# EAGLE design MainController (EAGLE 7.2.0)
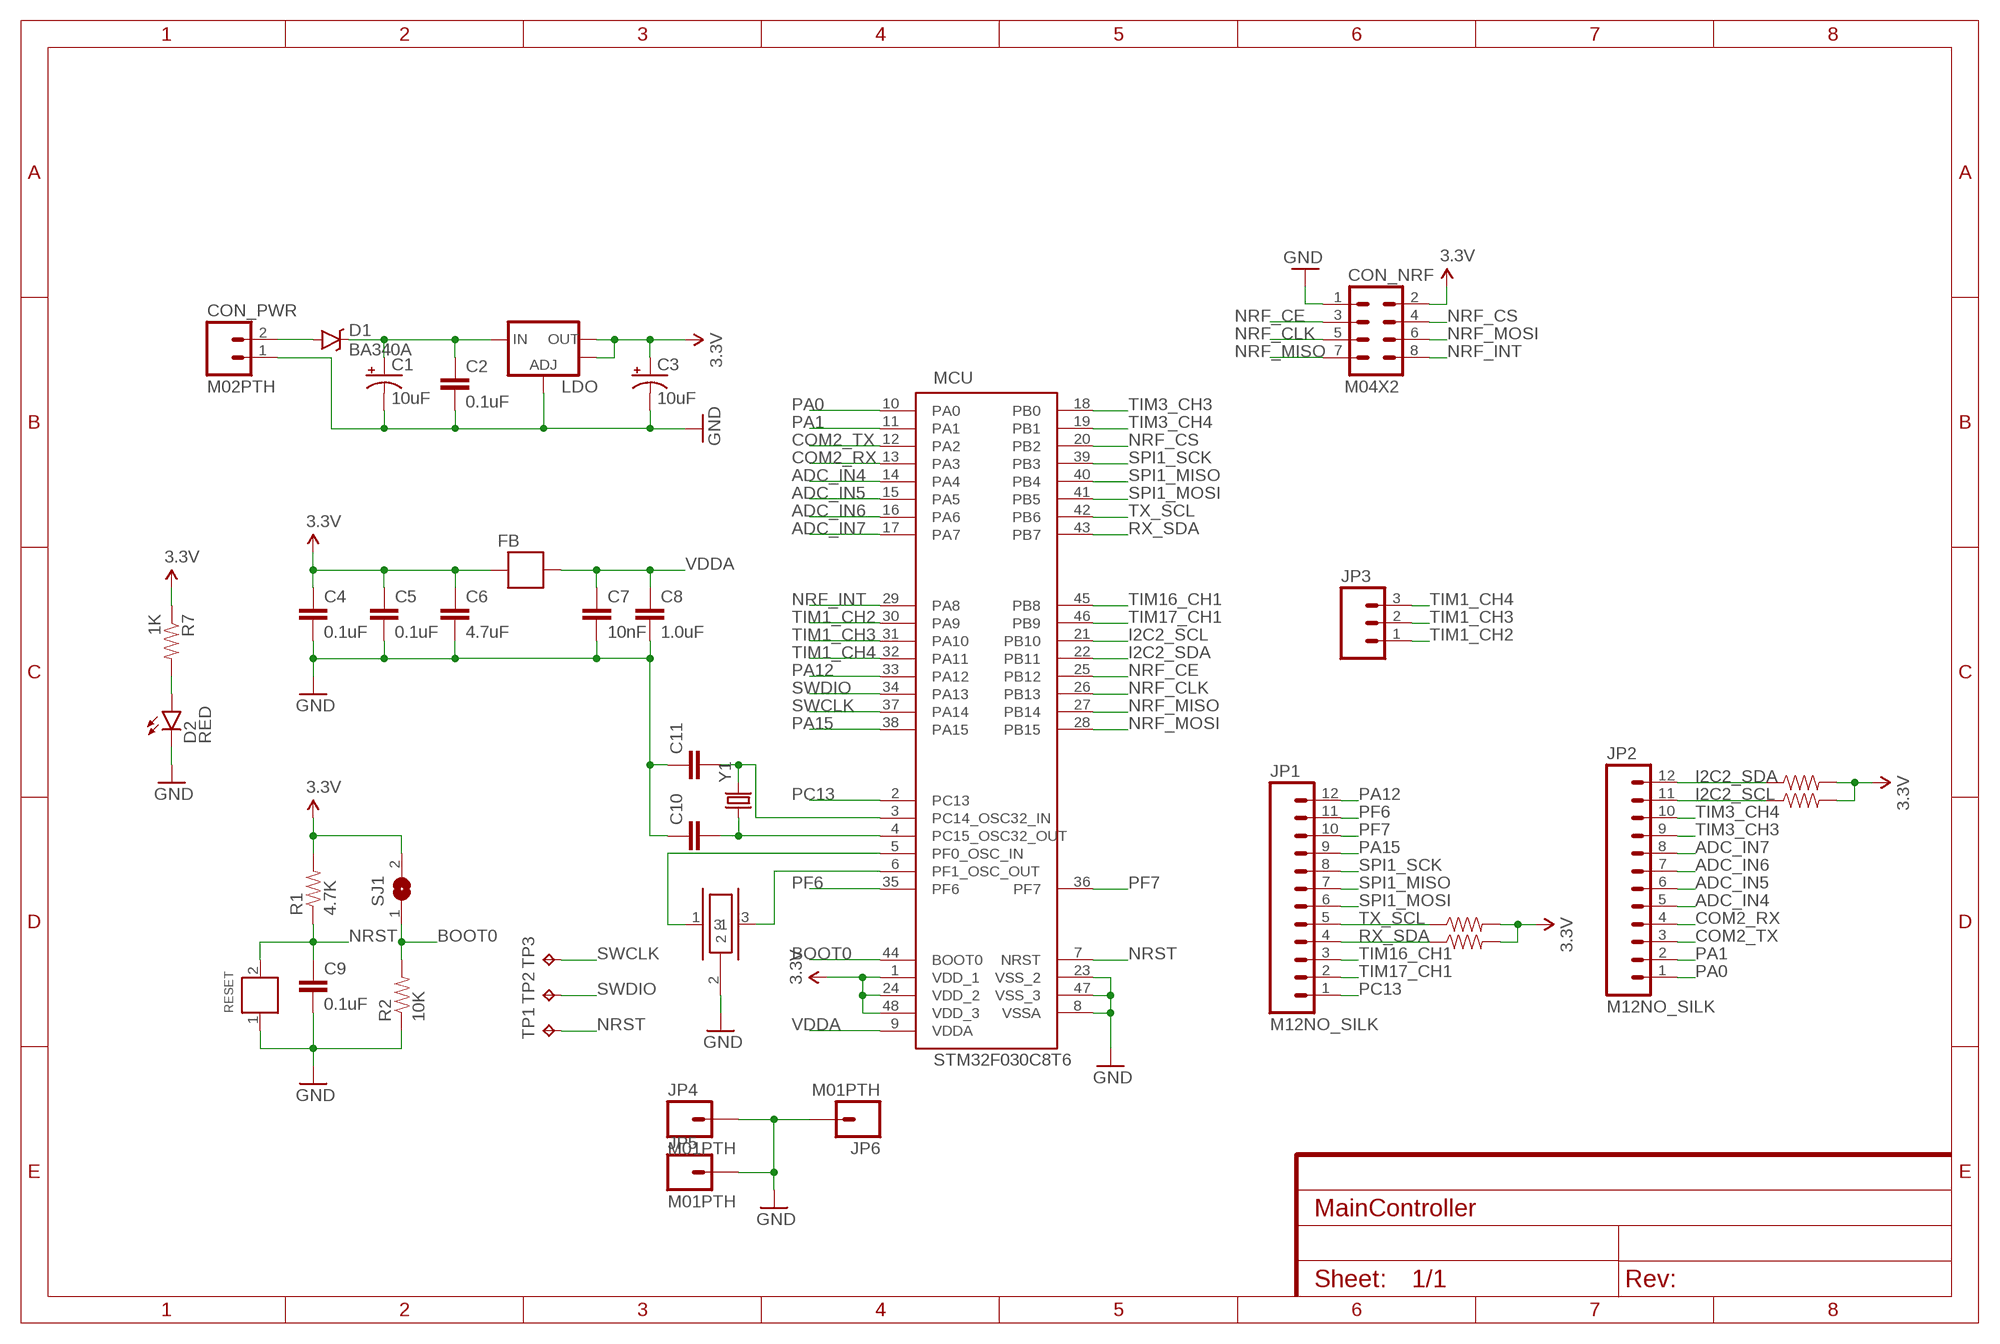
[diagram p0: schematic, sheet 1]

## Parts
C1  10uF  10UF-16V-10%(TANT)  [EIA3216]
C2  0.1uF  0.1UF-25V-5%(0603)  [0603-CAP]
C3  10uF  10UF-16V-10%(TANT)  [EIA3216]
C4  0.1uF  0.1UF-25V-5%(0603)  [0603-CAP]
C5  0.1uF  0.1UF-25V-5%(0603)  [0603-CAP]
C6  4.7uF  4.7UF-6.3V-10%(0603)0603  [0603-CAP]
C7  10nF  10NF/10000PF-50V-10%(0603)  [0603-CAP]
C8  1.0uF  1.0UF-16V-10%(0603)  [0603-CAP]
C9  0.1uF  0.1UF-100V-10%(0603)  [0603-CAP]
C10  CAP0603-CAP  [0603-CAP]
C11  CAP0603-CAP  [0603-CAP]
CON_NRF  M04X2  [2X4]
CON_PWR  M02PTH  [1X02]
D1  BA340A  B340A  [SMA-DIODE]
D2  RED  LED-RED0603  [LED-0603]
FB  FBFB0805  [0805W]
JP1  M12NO_SILK  [1X12_NO_SILK]
JP2  M12NO_SILK  [1X12_NO_SILK]
JP3  M031X03_NO_SILK  [1X03_NO_SILK]
JP4  M01PTH  [1X01]
JP5  M01PTH  [1X01]
JP6  M01PTH  [1X01]
LDO  V_REG_LM1117SOT223  [SOT223]
MCU  STM32F030C8T6  [TQFP48]
OSC  CSTCE8M00G52-R0  [CSTCE_M_G]
R1  4.7K  4.7KOHM-1/10W-1%(0603)  [0603-RES]
R2  10K  10KOHM-1/10W-1%(0603)0603  [0603-RES]
R3  10K  10OHM-1/10W-5%0603SMD  [0603-RES]
R4  10K  10OHM-1/10W-5%0603SMD  [0603-RES]
R5  10K  10OHM-1/10W-5%0603SMD  [0603-RES]
R6  10K  10OHM-1/10W-5%0603SMD  [0603-RES]
R7  1K  1KOHM-1/10W-1%(0603)  [0603-RES]
RESET  SWITCH_SMD  [SWITCH3X6_SMD]
SJ1  SJ  [SJ]
TP1  TPB1,27  [B1,27]
TP2  TPB1,27  [B1,27]
TP3  TPB1,27  [B1,27]
Y1  CRYSTALTC38H  [TC38H]

## Nets
3.3V: C3.A(+) C4.1 C5.1 C6.1 CON_NRF.2 FB.2 LDO.2(OUT) LDO.4(OUT) MCU.1(VDD_1) MCU.24(VDD_2) MCU.48(VDD_3) R1.2 R3.2 R4.2 R5.2 R6.2 R7.1 SJ1.2
ADC_IN4: JP2.5 MCU.14(PA4)
ADC_IN5: JP2.6 MCU.15(PA5)
ADC_IN6: JP2.7 MCU.16(PA6)
ADC_IN7: JP2.8 MCU.17(PA7)
BOOT0: MCU.44(BOOT0) R2.2 SJ1.1
COM2_RX: JP2.4 MCU.13(PA3)
COM2_TX: JP2.3 MCU.12(PA2)
GND: C1.C(-) C2.2 C3.C(-) C4.2 C5.2 C6.2 C7.2 C8.2 C9.2 C10.1 C11.1 CON_NRF.1 CON_PWR.1 D2.C JP4.1 JP5.1 JP6.1 LDO.1(ADJ) MCU.8(VSSA) MCU.23(VSS_2) MCU.47(VSS_3) OSC.2 R2.1 RESET.1
I2C2_SCL: JP2.11 MCU.21(PB10) R5.1
I2C2_SDA: JP2.12 MCU.22(PB11) R6.1
N$1: MCU.5(PF0_OSC_IN) OSC.1
N$2: MCU.6(PF1_OSC_OUT) OSC.3
N$3: C1.A(+) C2.1 D1.C LDO.3(IN)
N$4: C10.2 MCU.4(PC15_OSC32_OUT) Y1.1
N$5: C11.2 MCU.3(PC14_OSC32_IN) Y1.2
N$6: CON_PWR.2 D1.A
N$7: D2.A R7.2
NRF_CE: CON_NRF.3 MCU.25(PB12)
NRF_CLK: CON_NRF.5 MCU.26(PB13)
NRF_CS: CON_NRF.4 MCU.20(PB2)
NRF_INT: CON_NRF.8 MCU.29(PA8)
NRF_MISO: CON_NRF.7 MCU.27(PB14)
NRF_MOSI: CON_NRF.6 MCU.28(PB15)
NRST: C9.1 MCU.7(NRST) R1.1 RESET.2 TP1.TP
PA0: JP2.1 MCU.10(PA0)
PA1: JP2.2 MCU.11(PA1)
PA12: JP1.12 MCU.33(PA12)
PA15: JP1.9 MCU.38(PA15)
PC13: JP1.1 MCU.2(PC13)
PF6: JP1.11 MCU.35(PF6)
PF7: JP1.10 MCU.36(PF7)
RX_SDA: JP1.4 MCU.43(PB7) R4.1
SPI1_MISO: JP1.7 MCU.40(PB4)
SPI1_MOSI: JP1.6 MCU.41(PB5)
SPI1_SCK: JP1.8 MCU.39(PB3)
SWCLK: MCU.37(PA14) TP3.TP
SWDIO: MCU.34(PA13) TP2.TP
TIM1_CH2: JP3.1 MCU.30(PA9)
TIM1_CH3: JP3.2 MCU.31(PA10)
TIM1_CH4: JP3.3 MCU.32(PA11)
TIM3_CH3: JP2.9 MCU.18(PB0)
TIM3_CH4: JP2.10 MCU.19(PB1)
TIM16_CH1: JP1.3 MCU.45(PB8)
TIM17_CH1: JP1.2 MCU.46(PB9)
TX_SCL: JP1.5 MCU.42(PB6) R3.1
VDDA: C7.1 C8.1 FB.1 MCU.9(VDDA)

## Library data of the parts
C1 C3 = SparkFun-Capacitors:10UF-16V-10%(TANT): CAP-00811 1206/EIA-3216 Tantalum capacitor; PROD_ID: CAP-00811
C2 C4 C5 = SparkFun-Capacitors:0.1UF-25V-5%(0603): CAP-08604; PROD_ID: CAP-08604
C6 = SparkFun-Capacitors:4.7UF-6.3V-10%(0603): CAP-08280; PROD_ID: CAP-08280
C7 = SparkFun-Capacitors:10NF/10000PF-50V-10%(0603): CAP-00867; PROD_ID: CAP-00867
C8 = SparkFun-Capacitors:1.0UF-16V-10%(0603): CAP-00868; PROD_ID: CAP-00868
C9 = SparkFun-Capacitors:0.1UF-100V-10%(0603): CAP-08390; PROD_ID: CAP-08390
C10 C11 = SparkFun-Capacitors:CAP: Capacitor Standard 0603 ceramic capacitor, and 0.1" leaded capacitor.
CON_NRF = SparkFun-Connectors:M04X2: .1" header, two rows of four.
CON_PWR = SparkFun-Connectors:M02: Standard 2-pin 0.1" header. Use with - straight break away headers ( PRT-00116) - right angle break away headers (PRT-00553) - swiss pins (PRT-00743) - machine pins (PRT-00117) - female headers (PRT-00115) Molex polarized connector foot print use with: PRT-08233 with associated crimp pins and housings. 2.54_SCREWTERM for use with PRT-10571. 3.5mm Screw Terminal footprints for PRT-08084 5mm Screw Terminal footprints for use with PRT-08432
D1 = SparkFun-DiscreteSemi:B340A: Schottky Diode 3A-40V; PROD_ID: DIO-09886
D2 = SparkFun-LED:LED-RED: Assorted Red LEDs LilyPad 1206- DIO-09912 1206- DIO-00809 0603- DIO-00819; PROD_ID: DIO-00819
FB = SparkFun-Passives:FB
JP1 JP2 = SparkFun-Connectors:M12: Header 12 Standard 12-pin 0.1" header. Use with straight break away headers (SKU : PRT-00116), right angle break away headers (PRT-00553), swiss pins (PRT-00743), machine pins (PRT-00117), and female headers (PRT-00115).
JP3 = SparkFun-Connectors:M03: Header 3 Standard 3-pin 0.1" header. Use with straight break away headers (SKU : PRT-00116), right angle break away headers (PRT-00553), swiss pins (PRT-00743), machine pins (PRT-00117), and female headers (PRT-00115). Molex polarized connector foot print use with SKU : PRT-08232 with associated crimp pins and housings.
JP4-JP6 = SparkFun-Connectors:M01: Header 1 Standard 1-pin 0.1" header. Use with straight break away headers (SKU : PRT-00116), right angle break away headers (PRT-00553), swiss pins (PRT-00743), machine pins (PRT-00117), and female headers (PRT-00115).
LDO = SparkFun-PowerIC:V_REG_LM1117: Voltage Regulator LM1117 Standard adjustable voltage regulator but in SMD form. Spark Fun Electronics SKU : COM-00595; PROD_ID: VREG-08170
MCU = stm32:STM32F030C8T6
OSC = murata:CSTCE8M00G52-R0
R1 = SparkFun-Resistors:4.7KOHM-1/10W-1%(0603): RES-07857; PROD_ID: RES-07857
R2 = SparkFun-Resistors:10KOHM-1/10W-1%(0603): RES-00824; PROD_ID: RES-00824
R3-R6 = SparkFun-Resistors:10OHM-1/10W-5%0603: RES-09834; PROD_ID: RES-09834; VALUE: 10
R7 = SparkFun-Resistors:1KOHM-1/10W-1%(0603): RES-07856; PROD_ID: RES-07856
RESET = szjlc:SWITCH_SMD
SJ1 = jumper:SJ: SMD solder JUMPER
TP1-TP3 = testpad:TP: Test pad
Y1 = SparkFun-FreqCtrl:CRYSTAL: Various standard crystals. Proven footprints.

## Board
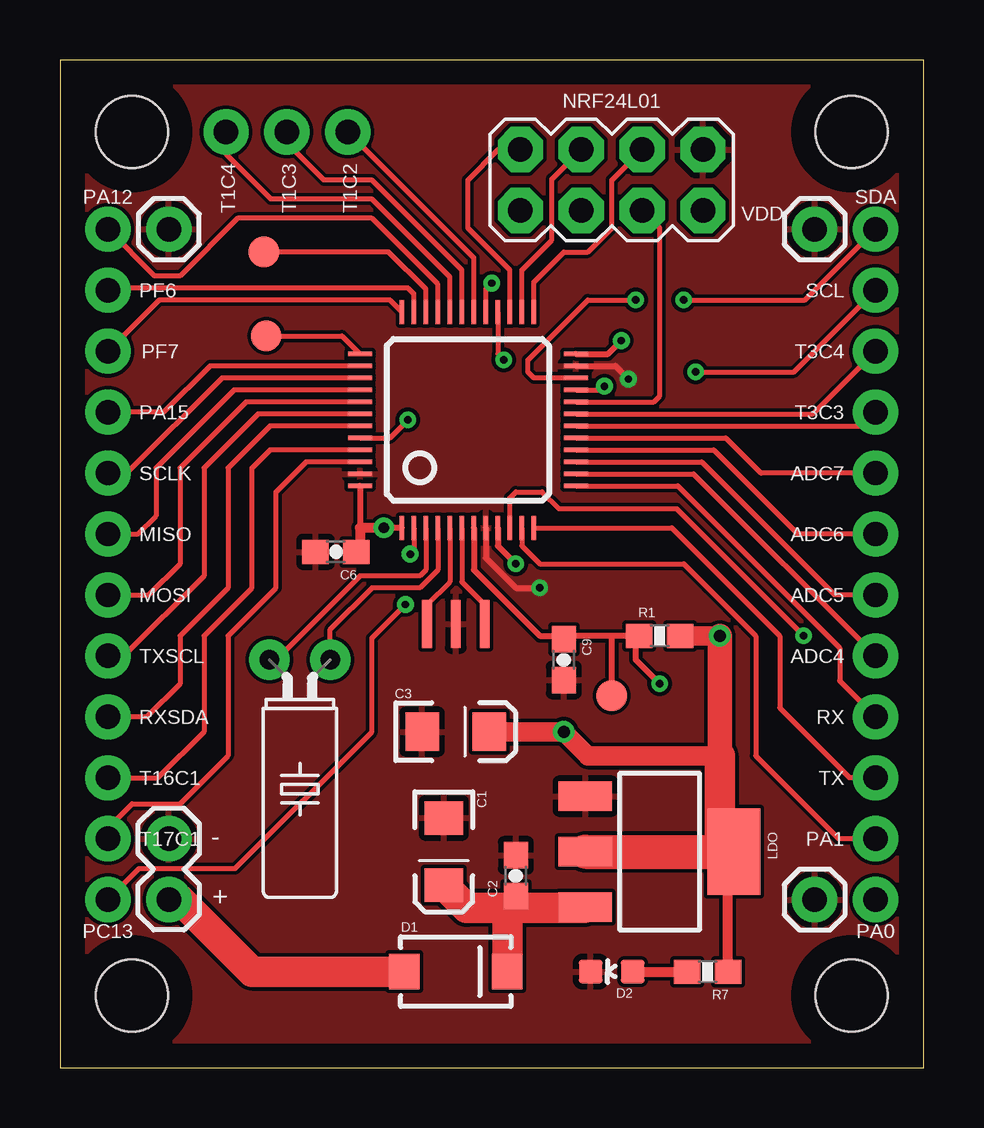
[diagram p1: board, top side]
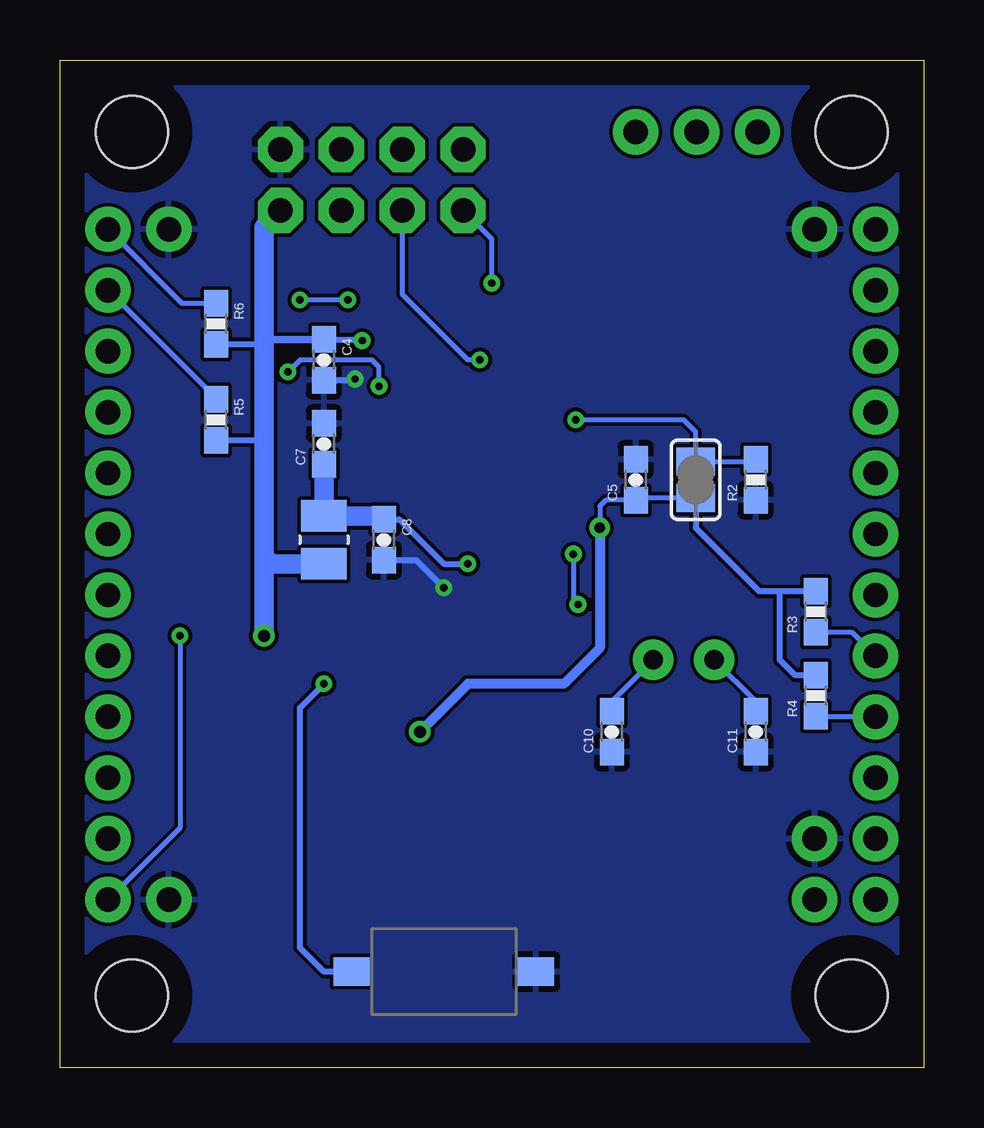
[diagram p2: board, bottom side, seen from below]

Size 36 x 42 mm. Coordinates in mm from the lower left corner, seen from the top.
Outline: 0,0 36,0 36,42 0,42 0,0
Copper layers (1*16): Top 0.035mm / dielectric 1.5mm / Bottom 0.035mm
Design rules "default *": minimum track width 6mil, minimum drill 0.3mm, track to track 6mil, track to pad 6mil, pad to pad 6mil, via to via 6mil, smd to smd 6mil, copper to edge 40mil, drill to drill 8mil, minimum pad ring 10mil, minimum via ring 8mil, stop-mask expansion 4mil, vias tented up to drill 0.5mm, thermal gap 10mil
Holes 3 mm at 3,3 33,3 33,39 3,39

### Footprints (pad centres in the part's own frame; a part is rotated, then mirrored left to right if it is on the bottom)
EIA3216 = smd 1.4 x 1.6: A 1.4,0; C -1.4,0
0603-CAP = smd 1.1 x 1: 1 -0.85,0; 2 0.85,0
2X4 = drill 1.016 pad 1.88 octagon: 1 -3.81,-1.27; 2 -3.81,1.27; 3 -1.27,-1.27; 4 -1.27,1.27; 5 1.27,-1.27; 6 1.27,1.27; 7 3.81,-1.27; 8 3.81,1.27
1X02 = drill 1.016 pad 1.88: 1 0,0; 2 2.54,0
SMA-DIODE = smd 1.27 x 1.47: A -2.15,0; C 2.15,0
LED-0603 = smd 1 x 1: A 0,-0.877; C 0,0.877
0805W = smd 1.3 x 1.9: 1 -1,0; 2 1,0
1X12_NO_SILK = drill 1.016 pad 1.88: 1 0,0; 2 2.54,0; 3 5.08,0; 4 7.62,0; 5 10.16,0; 6 12.7,0; 7 15.24,0; 8 17.78,0; 9 20.32,0; 10 22.86,0; 11 25.4,0; 12 27.94,0
1X03_NO_SILK = drill 1.016 pad 1.88: 1 0,0; 2 2.54,0; 3 5.08,0
1X01 = drill 1.016 pad 1.88: 1 0,0
SOT223 = smd 1.219 x 2.235: 1 -2.311,-3.099; 2 0,-3.099; 3 2.311,-3.099 | smd 3.6 x 2.2: 4 0,3.099
TQFP48 = smd 0.2 x 1: 1 -2.75,-4.5; 2 -2.25,-4.5; 3 -1.75,-4.5; 4 -1.25,-4.5; 5 -0.75,-4.5; 6 -0.25,-4.5; 7 0.25,-4.5; 8 0.75,-4.5; 9 1.25,-4.5; 10 1.75,-4.5; 11 2.25,-4.5; 12 2.75,-4.5; 25 2.75,4.5; 26 2.25,4.5; 27 1.75,4.5; 28 1.25,4.5; 29 0.75,4.5; 30 0.25,4.5; 31 -0.25,4.5; 32 -0.75,4.5; 33 -1.25,4.5; 34 -1.75,4.5; 35 -2.25,4.5; 36 -2.75,4.5 | smd 1 x 0.2: 13 4.5,-2.75; 14 4.5,-2.25; 15 4.5,-1.75; 16 4.5,-1.25; 17 4.5,-0.75; 18 4.5,-0.25; 19 4.5,0.25; 20 4.5,0.75; 21 4.5,1.25; 22 4.5,1.75; 23 4.5,2.25; 24 4.5,2.75; 37 -4.5,2.75; 38 -4.5,2.25; 39 -4.5,1.75; 40 -4.5,1.25; 41 -4.5,0.75; 42 -4.5,0.25; 43 -4.5,-0.25; 44 -4.5,-0.75; 45 -4.5,-1.25; 46 -4.5,-1.75; 47 -4.5,-2.25; 48 -4.5,-2.75
CSTCE_M_G = smd 0.4 x 2: 1 -1.2,0; 2 0,0; 3 1.2,0
0603-RES = smd 1.1 x 1: 1 -0.85,0; 2 0.85,0
SWITCH3X6_SMD = smd 1.5 x 1.2: 1 -3.85,0; 2 3.85,0
SJ = smd 1.168 x 1.6: 1 -0.762,0; 2 0.762,0
B1,27 = smd 1.27 x 1.27: TP 0,0
TC38H = drill 0.813 pad 1.676: 1 -1.27,0; 2 1.27,0

### Placement (x,y rotation side)
C1  16,9 270 top
C2  19,8 90 top
C3  16.5,14 0 top
C4  25,29.5 270 bottom
C5  12,24.5 90 bottom
C6  11.5,21.5 180 top
C7  25,26 90 bottom
C8  22.5,22 270 bottom
C9  21,17 270 top
C10  13,14 90 bottom
C11  7,14 90 bottom
CON_NRF  23,37 180 top
CON_PWR  4.54,9.54 270 top
D1  16.5,4 0 top
D2  23,4 90 top
FB  25,22 270 bottom
JP1  2,7 90 top
JP2  34,7 90 top
JP3  12,39 180 top
JP4  4.54,34.94 0 top
JP5  31.46,34.94 0 top
JP6  31.46,7 0 top
LDO  25,9 270 top
MCU  17,27 0 top
OSC  16.5,18.5 0 top
R1  25,18 0 top
R2  7,24.5 90 bottom
R3  4.5,19 90 bottom
R4  4.5,15.5 90 bottom
R5  29.5,27 270 bottom
R6  29.5,31 270 bottom
R7  27,4 180 top
RESET  20,4 180 bottom
SJ1  9.5,24.5 270 bottom
TP1  23,15.5 0 top
TP2  8.5,34 0 top
TP3  8.6,30.5 0 top
Y1  10,17 180 top

### Tracks (layer width: path | path; a pad name or v marks a point on that pad's centre or on a via)
3.3V  (via drill 0.3, 0.45, 0.5)
  Top 0.254: MCU.24 22.85,29.75 v23.4,30.3 | MCU.48 12.5,22.5 | MCU.1 v13.5,22.5
  Top 0.406: v13.5,22.5 12.5,22.5 12.5,21.65 C6.1 | 28,8.9 LDO.4 27.85,8.75 R7.1
  Top 0.813: R1.2 v27.5,18 | C3.A v21,14 22,13 27.5,13
  Top 1.016: 28.4,9.3 LDO.4 27.5,9.6 | v27.5,18 27.5,13
  Top 1.27: 27.5,13 27.5,9.6
  Top 1.422: LDO.2 LDO.4
  Bottom 0.2: SJ1.2 11.91,23.74 C5.1 13.25,23.65 13.5,23.4 v13.5,22.5
  Bottom 0.254: C4.1 23.45,30.35 v23.4,30.3 | R6.2 27.65,30.15 | R5.2 27.65,26.15 | R3.2 6,19.85 | 6,19.85 6.85,19.85 9.5,22.5 SJ1.2 | R4.2 5.35,16.35 6,17 6,19.85
  Bottom 0.305: C4.1 27.15,30.35 27.5,30
  Bottom 0.406: v13.5,22.5 13.5,17.5 15,16 19,16 v21,14 | 27.65,30.15 27.5,30 | 27.65,26.15 27.5,26
  Bottom 0.61: 27.35,21.15 27.5,21
  Bottom 0.813: v27.5,18 27.5,21 27.5,26 27.5,30 27.5,35.04 CON_NRF.2 | FB.2 27.2,21 27.35,21.15
ADC_IN4
  Top 0.2: MCU.14 26.41,24.75 JP2.5
ADC_IN5
  Top 0.2: MCU.15 26.75,25.25 32.3,19.7 JP2.6
ADC_IN6
  Top 0.2: MCU.16 27.25,25.75 30.76,22.24 JP2.7
ADC_IN7
  Top 0.2: MCU.17 27.75,26.25 29,25 29.22,24.78 JP2.8
BOOT0  (via drill 0.3)
  Top 0.2: MCU.44 13.75,26.25 v14.5,27
  Bottom 0.2: v14.5,27 10,27 9.5,26.5 SJ1.1 7.09,25.26 R2.2
COM2_RX
  Top 0.2: MCU.13 25.75,24.25 32.5,17.5 32.5,16.12 JP2.4
COM2_TX
  Top 0.2: MCU.12 25.5,22.5 30,18 30,15 32.92,12.08 JP2.3
GND  (via drill 0.3)
  Top 0.254: MCU.23 23.15,29.25 v23.7,28.7 | MCU.8 17.75,21.25 19,20 v20,20
  Bottom 0.254: C4.2 23.75,28.65 v23.7,28.7 | C8.2 21.15,21.15 v20,20
  pour Top: 0,42 36,42 36,0 0,0
  pour Bottom: 0,42 0,0 36,0 36,42
I2C2_SCL  (via drill 0.3)
  Top 0.2: MCU.21 22.55,28.25 v22.7,28.4 | v26.5,29 30.6,29 JP2.11
  Bottom 0.2: v26.5,29 26,29.5 23,29.5 22.7,29.2 v22.7,28.4 | R5.1 29.5,27.9 JP2.11
I2C2_SDA  (via drill 0.3)
  Top 0.2: MCU.22 19.75,28.75 19.5,29 19.5,29.5 22,32 v24,32 | v26,32 31.06,32 JP2.12
  Bottom 0.2: v24,32 v26,32 | R6.1 30.91,31.85 JP2.12
N$1
  Top 0.2: MCU.5 16.25,20.25 15.3,19.3 OSC.1
N$2
  Top 0.2: MCU.6 16.75,20.25 17.7,19.3 OSC.3
N$3
  Top 0.813: C2.1 19,6.65
  Top 1.016: 21.86,6.65 LDO.3 | 19,6.65 18.6,6.65
  Top 1.27: 19,6.65 21.86,6.65 | C1.A 16.95,6.65 18.6,6.65 18.65,6.6 D1.C
N$4
  Top 0.2: MCU.4 15.75,20.75 15,20 13,20 11.27,18.27 Y1.1
  Bottom 0.2: C10.2 13,15.27 Y1.1
N$5
  Top 0.2: MCU.3 15.25,20.75 15,20.5 12.5,20.5 9,17 Y1.2
  Bottom 0.2: C11.2 7,15.27 Y1.2
N$6
  Top 1.27: CON_PWR.2 5,7 8,4 D1.A
N$7
  Top 0.406: D2.A R7.2
NRF_CE
  Top 0.2: MCU.25 19.75,32.75 21,34 22,34 23,35 23,37 CON_NRF.3
NRF_CLK
  Top 0.2: MCU.26 19.25,33.25 20.5,34.5 20.5,37.04 CON_NRF.5
NRF_CS
  Top 0.2: MCU.20 24.75,27.75 25,28 25,35 CON_NRF.4
NRF_INT  (via drill 0.3)
  Top 0.2: MCU.29 17.75,32.45 v18,32.7
  Bottom 0.2: v18,32.7 18,34.54 CON_NRF.8
NRF_MISO
  Top 0.2: MCU.27 18.75,33.25 17,35 17,37 18.27,38.27 CON_NRF.7
NRF_MOSI  (via drill 0.3)
  Top 0.2: MCU.28 18.25,29.75 v18.5,29.5
  Bottom 0.2: v18.5,29.5 19,29.5 21.73,32.23 CON_NRF.6
NRST  (via drill 0.3)
  Top 0.254: MCU.7 17.25,20.75 20,18 20.85,18 C9.1 21.15,18 23,18 | 23,18 R1.1 24,17.85 24,17 v25,16 | TP1.TP 23,18
  Bottom 0.254: v25,16 26,15 26,5 25,4 RESET.2
PA0  (via drill 0.3)
  Top 0.2: MCU.10 18.75,23.75 19,24 20.1,24 20.8,23.3 25.7,23.3 v31,18
  Bottom 0.2: v31,18 31,10 JP2.1
PA1
  Top 0.2: MCU.11 19.25,21.75 20,21 26,21 29,18 29,13 32.46,9.54 JP2.2
PA12
  Top 0.2: MCU.33 15.75,32.65 13,35.4 7.4,35.4 5,33 3.94,33 JP1.12
PA15
  Top 0.2: MCU.38 6.25,29.25 4.32,27.32 JP1.9
PC13  (via drill 0.3)
  Top 0.2: MCU.2 14.75,21.55 v14.6,21.4 | v14.4,19.3 13,17.9 13,14 7.3,8.3 3.3,8.3 JP1.1
  Bottom 0.2: v14.6,21.4 14.6,19.5 v14.4,19.3
PF6
  Top 0.2: MCU.35 14.75,32.25 14.5,32.5 2.1,32.5 JP1.11
PF7
  Top 0.2: MCU.36 13.75,32 4.14,32 JP1.10
RX_SDA
  Top 0.2: MCU.43 8.75,26.75 7,25 7,20 5,18 5,16 3.62,14.62 JP1.4
  Bottom 0.2: JP1.4 4.47,14.62 R4.1
SPI1_MISO
  Top 0.2: MCU.40 7.25,28.25 4,25 4,23 3.24,22.24 JP1.7
SPI1_MOSI
  Top 0.2: MCU.41 7.75,27.75 5,25 5,21 3.7,19.7 JP1.6
SPI1_SCK
  Top 0.2: MCU.39 6.75,28.75 2.78,24.78 JP1.8
SWCLK
  Top 0.2: TP3.TP 11.75,30.5 MCU.37
SWDIO
  Top 0.2: MCU.34 15.25,32.45 13.7,34 TP2.TP
TIM1_CH2
  Top 0.2: MCU.30 17.25,33.75 JP3.1
TIM1_CH3
  Top 0.2: MCU.31 16.75,33.25 13,37 11,37 9.46,38.54 JP3.2
TIM1_CH4
  Top 0.2: MCU.32 16.25,32.95 13,36.2 8.8,36.2 6.92,38.08 JP3.3
TIM3_CH3
  Top 0.2: MCU.18 33.43,26.75 JP2.9
TIM3_CH4
  Top 0.2: MCU.19 31.39,27.25 JP2.10
TIM16_CH1
  Top 0.2: MCU.45 8.75,25.75 8,25 8,20 6,18 6,14 4.08,12.08 JP1.3
TIM17_CH1
  Top 0.2: MCU.46 10.25,25.25 9,24 9,20 7,18 7,13 5,11 3,11 2,10 JP1.2
TX_SCL
  Top 0.2: MCU.42 8.25,27.25 6,25 6,20.5 2.66,17.16 JP1.5
  Bottom 0.2: R3.1 2.99,18.15 JP1.5
VDDA  (via drill 0.3)
  Top 0.254: MCU.9 18.25,21.75 v19,21
  Bottom 0.254: v19,21 20,21 21.85,22.85 C8.1
  Bottom 0.813: C7.1 FB.1 22.65,23 C8.1

### Text on the board
tPlace: NRF24L01 | T1C4 | T1C3 | T1C2 | PA12 | SDA | VDD | PF6 | SCL | PF7 | T3C4 | PA15 | T3C3 | SCLK | ADC7 | MISO | ADC6 | MOSI | ADC5 | TXSCL | ADC4 | RXSDA | RX | T16C1 | TX | T17C1 | - | PA1 | + | PC13 | PA0